# Altium schematic sheet MLX90614 sensor.SchDoc
size A4; SheetNumber: 3; SheetTotal: 4
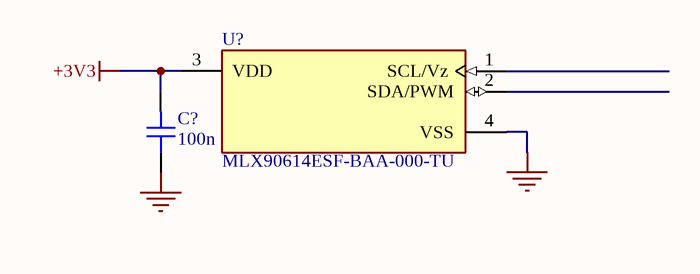
[diagram p0: MLX90614 sensor.SchDoc]

## Parts
C?  100n  [CAP_0402]
U?  MLX90614ESF-BAA-000-TU  [FP-MLX90614ESF-BAA-000-TU-MFG]

## Nets
+3V3: C?.1 U?.3(VDD)
GND: C?.2 U?.4(VSS)

Not connected (* = marked no-connect by the designer): U? 1(SCL/Vz) 2(SDA/PWM)

## Library data of the parts
C? = CAP_0402_16V: Capacitor SMD 0402 16V
U? = CMP-116302-000007-1: SENSOR DGTL -40C-85C TO39; Resolution: 16b; Sensing Method: Infrared (IR); Output Type: PWM; Max Output Current: 11mA; Operating Supply Voltage: 3.6V; Lead Free: Lead Free; Packaging: Rail/Tube; Mount: Through Hole; Series: -; Max Operating Temperature: 85°C; Case/Package: TO-39-4; RoHS Compliant: Yes; Min Operating Temperature: -40°C; Package Quantity: 55